# Altium schematic sheet Power.SchDoc
size 594 x 420 mm; SheetNumber: 10; SheetTotal: 10; Обозначение документа: QFP power; Номер листа: 10; Общее количество листов: 10
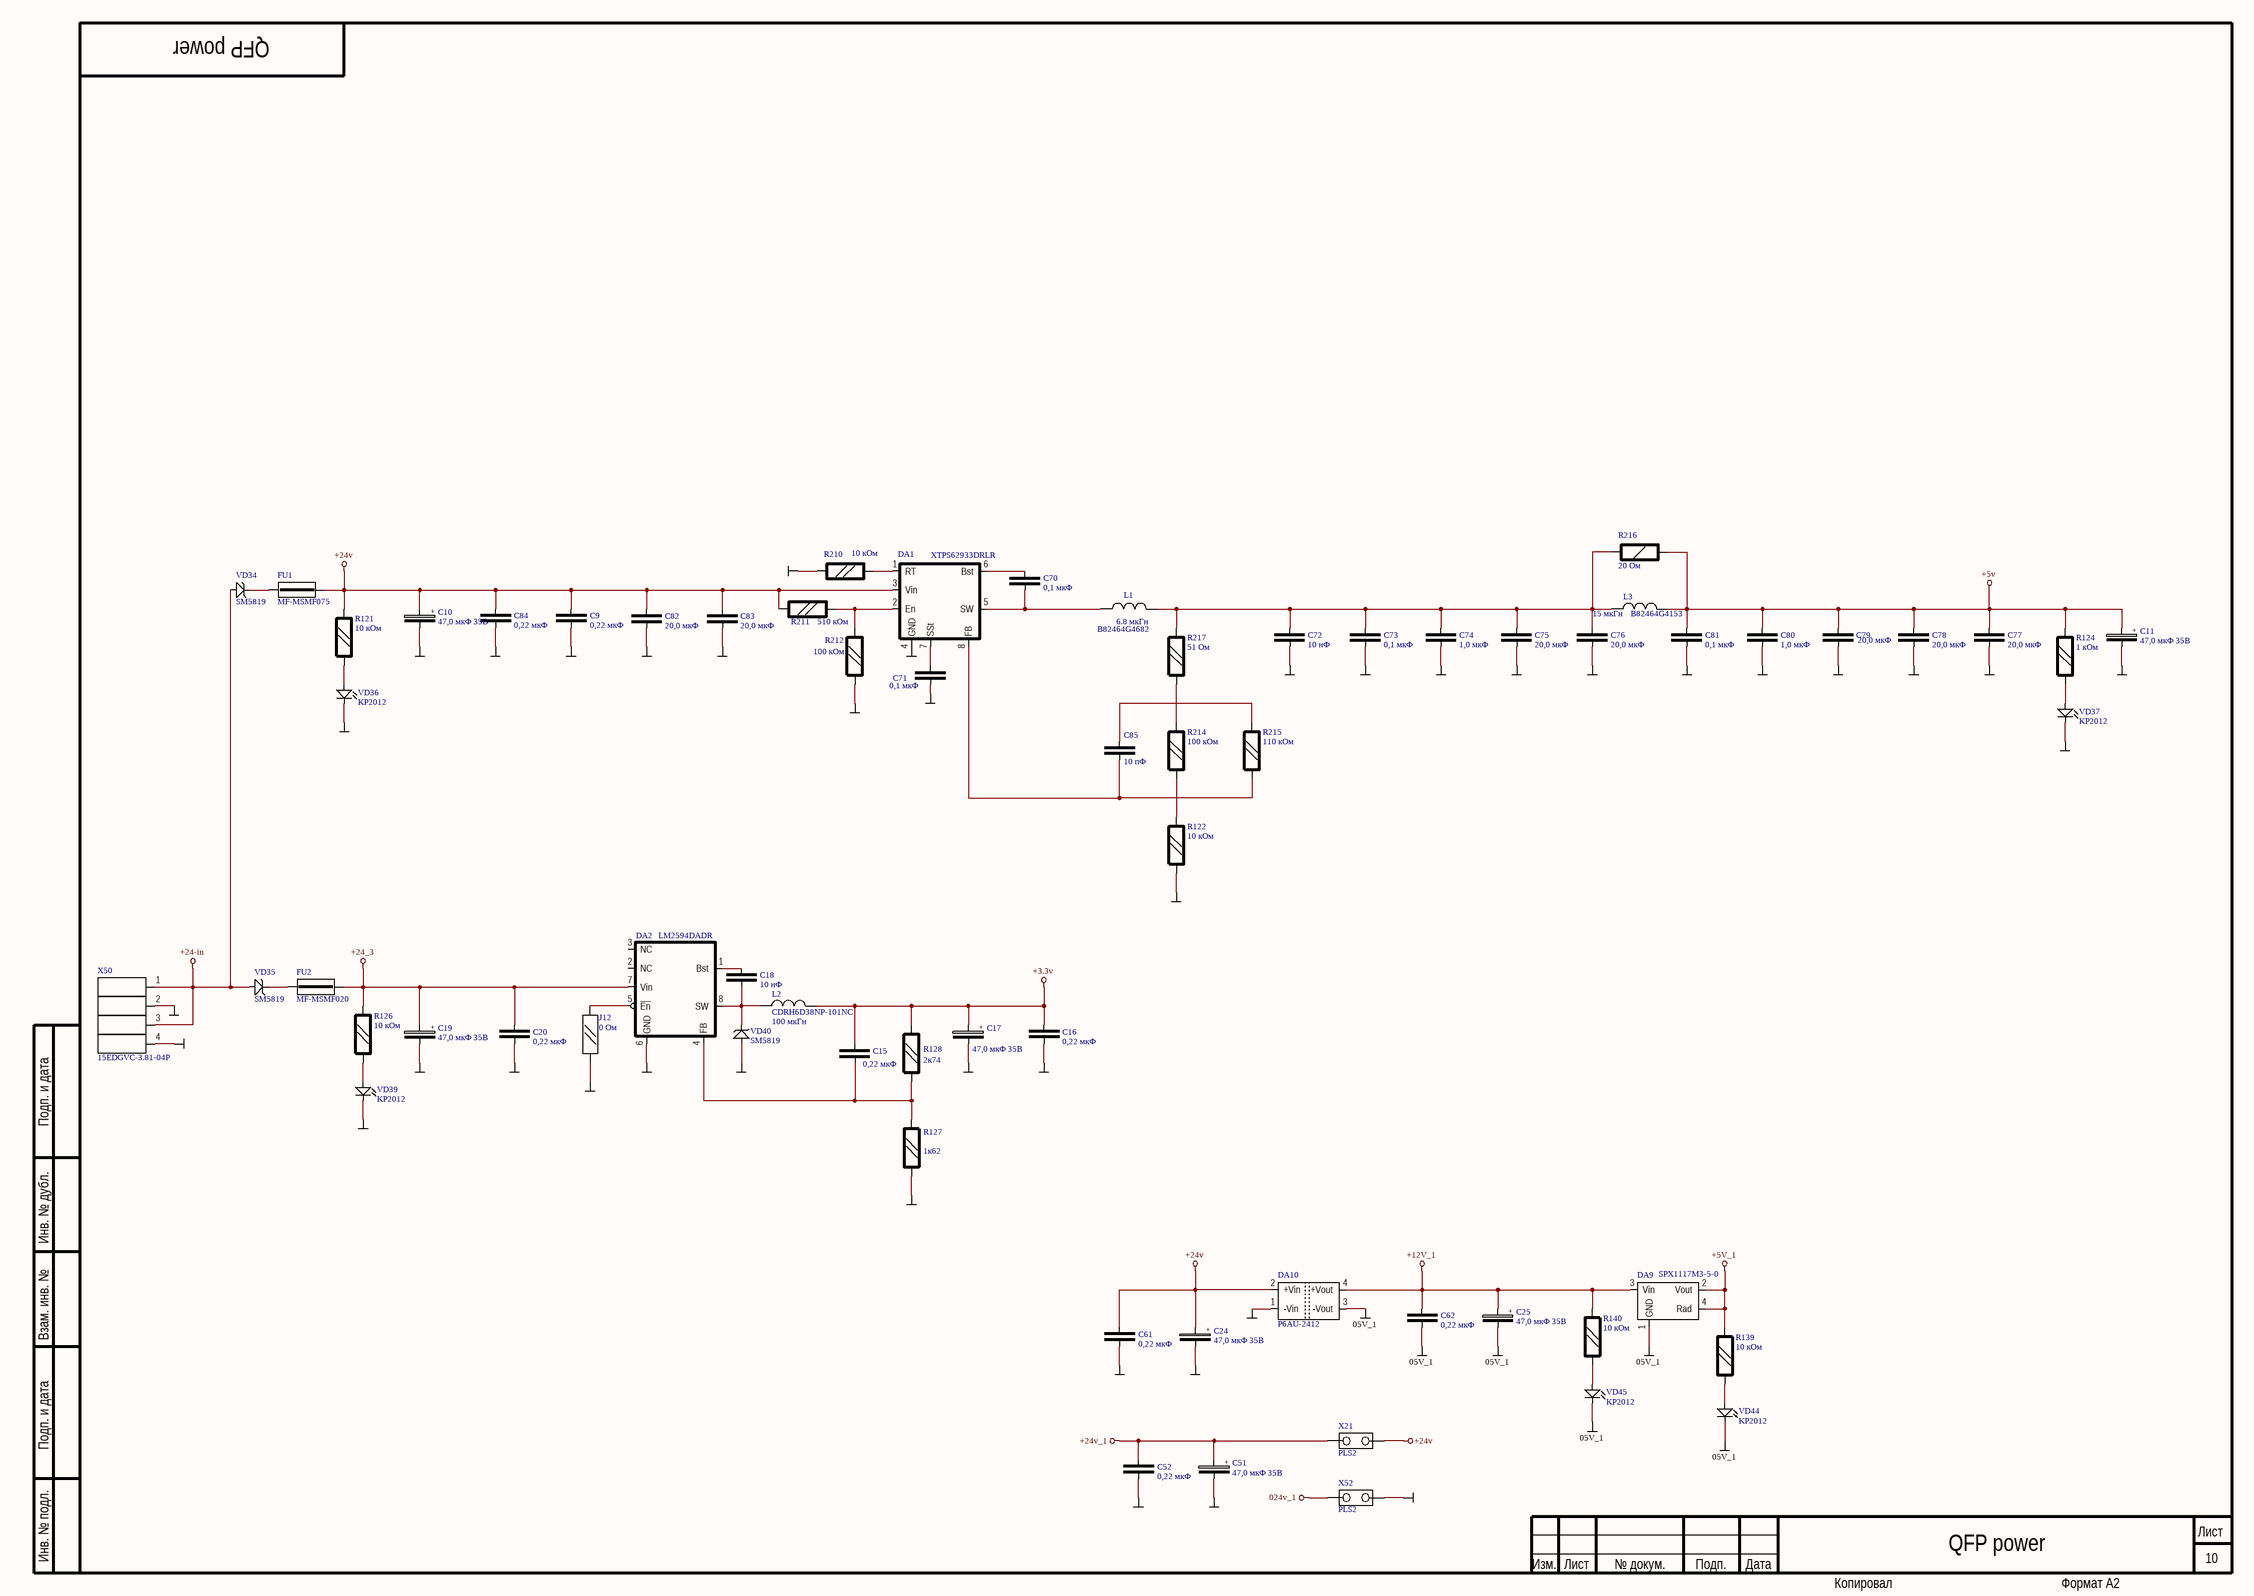
[diagram p0: Power.SchDoc]

## Parts
C9  0,22 мкФ  [RC0805]
C10  47,0 мкФ 35В  [cap6]
C11  47,0 мкФ 35В  [cap6]
C15  0,22 мкФ  [SMD0805CAP]
C16  0,22 мкФ  [RC0805]
C17  47,0 мкФ 35В  [cap6]
C18  10 нФ  [RC0805]
C19  47,0 мкФ 35В  [cap6]
C20  0,22 мкФ  [RC0805]
C24  47,0 мкФ 35В  [cap6]
C25  47,0 мкФ 35В  [cap6]
C51  47,0 мкФ 35В  [cap6]
C52  0,22 мкФ  [SMD0805CAP]
C61  0,22 мкФ  [SMD0805CAP]
C62  0,22 мкФ  [SMD0805CAP]
C70  0,1 мкФ  [SMD0805CAP]
C71  0,1 мкФ  [SMD0805CAP]
C72  10 нФ  [SMD0805CAP]
C73  0,1 мкФ  [SMD0805CAP]
C74  1,0 мкФ  [SMD0805CAP]
C75  20,0 мкФ  [CAPC1206]
C76  20,0 мкФ  [CAPC1206]
C77  20,0 мкФ  [CAPC1206]
C78  20,0 мкФ  [CAPC1206]
C79  20,0 мкФ  [CAPC1206]
C80  1,0 мкФ  [SMD0805CAP]
C81  0,1 мкФ  [SMD0805CAP]
C82  20,0 мкФ  [CAPC1206]
C83  20,0 мкФ  [CAPC1206]
C84  0,22 мкФ  [RC0805]
C85  10 пФ  [RC0805]
DA1  XTPS62933DRLR  [SOT583]
DA2  LM2594DADR  [SO8]
DA9  SPX1117M3-5-0  [SOT223]
DA10  P6AU-2412  [SiP4]
FU1  MF-MSMF075  [MSMF020]
FU2  MF-MSMF020  [MSMF020]
J12  0 Ом  [SMD0805RES]
L1  B82464G4682  Inductance: 6.8 мкГн  [IND_COILCRAFT_MSS1038]
L2  CDRH6D38NP-101NC  Inductance: 100 мкГн  [cdrh6d38np]
L3  B82464G4153  Inductance: 15 мкГн  [IND_COILCRAFT_MSS1038]
R121  10 кОм  [SMD0805RES]
R122  10 кОм  [SMD0805RES]
R124  1 кОм  [SMD0805RES]
R126  10 кОм  [SMD0805RES]
R127  1к62  [SMD0805RES]
R128  2к74  [SMD0805RES]
R139  10 кОм  [SMD0805RES]
R140  10 кОм  [SMD0805RES]
R210  10 кОм  [SMD0805RES]
R211  510 кОм  [SMD0805RES]
R212  100 кОм  [SMD0805RES]
R214  100 кОм  [SMD0805RES]
R215  110 кОм  [SMD0805RES]
R216  20 Ом  [RES1206]
R217  51 Ом  [SMD0805RES]
VD34  SM5819  [MELF]
VD35  SM5819  [MELF]
VD36  KP2012  [SMD0805DIO_C]
VD37  KP2012  [SMD0805DIO_C]
VD39  KP2012  [SMD0805DIO_C]
VD40  SM5819  [MELF]
VD44  KP2012  [SMD0805DIO_C]
VD45  KP2012  [SMD0805DIO_C]
X21  PLS2  [PLS2]
X50  15EDGVC-3.81-04P  [15EDGVC_081_4]
X52  PLS2  [PLS2]

## Nets
05V_1: C25.2(-) C62.2 DA9.1(GND) DA10.3(-Vout) VD44.1(Cathode) VD45.1(Cathode)
024v_1: X52.1
+3.3v: C15.2 C16.1 C17.1(+) L2.1 R128.2
+5v: C11.1(+) C77.2 C78.2 C79.2 C80.2 C81.2 L3.2 R124.2 R216.2
+5V_1: DA9.2(Vout) DA9.4(Rad) R139.1
+12V_1: C25.1(+) C62.1 DA9.3(Vin) DA10.4(+Vout) R140.1
+24-in: VD34.2(Anode) VD35.2(Anode) X50.1 X50.3
+24_3: C19.1(+) C20.1 DA2.7(Vin) FU2.1 R126.2
+24v: C9.1 C10.1(+) C24.1(+) C61.1 C82.2 C83.2 C84.1 DA1.3(Vin) DA10.2(+Vin) FU1.1 R121.2 R211.1 X21.2
+24v_1: C51.1(+) C52.1 X21.1
GND: C9.2 C10.2(-) C11.2(-) C16.2 C17.2(-) C19.2(-) C20.2 C24.2(-) C51.2(-) C52.2 C61.2 C71.1 C72.1 C73.1 C74.1 C75.1 C76.1 C77.1 C78.1 C79.1 C80.1 C81.1 C82.1 C83.1 C84.2 DA1.4(GND) DA2.6(GND) DA10.1(-Vin) J12.2 R122.1 R127.2 R210.1 R212.1 VD36.1(Cathode) VD37.1(Cathode) VD39.1(Cathode) VD40.2(Anode) X50.2 X50.4 X52.2
NetC15_1: C15.1 DA2.4(FB) R127.1 R128.1
NetC18_1: C18.1 DA2.1(Bst)
NetC18_2: C18.2 DA2.8(SW) L2.2 VD40.1(Cathode)
NetC70_1: C70.1 DA1.5(SW) L1.1
NetC70_2: C70.2 DA1.6(Bst)
NetC71_2: C71.2 DA1.7(SSt)
NetC72_2: C72.2 C73.2 C74.2 C75.2 C76.2 L1.2 L3.1 R216.1 R217.2
NetC85_1: C85.1 R215.2
NetC85_2: C85.2 DA1.8(FB) R215.1
NetDA1_1: DA1.1(RT) R210.2
NetDA1_2: DA1.2(En) R211.2 R212.2
NetDA2_5: DA2.5(~{En}) J12.1
NetFU1_2: FU1.2 VD34.1(Cathode)
NetFU2_2: FU2.2 VD35.1(Cathode)
NetR121_1: R121.1 VD36.2(Anode)
NetR122_2: R122.2 R214.1
NetR124_1: R124.1 VD37.2(Anode)
NetR126_1: R126.1 VD39.2(Anode)
NetR139_2: R139.2 VD44.2(Anode)
NetR140_2: R140.2 VD45.2(Anode)
NetR214_2: R214.2 R217.1

Not connected (* = marked no-connect by the designer): DA2 2(NC) 3(NC)

## Notes on the sheet
- Подп. и дата
- Инв. № дубл.
- Взам. инв. №
- Инв. № подл.
- Изм.
- Лист
- № докум.
- Подп.
- Дата
- Копировал
- Формат А2

## Library data of the parts
C9 C16 C18 C20 C84 = C0805Big: Чип конденсатор 0805; Voltage: 50V; Vendor: Generic; Temp: Y5V; Tol: 20%; SolderOptoin: Norm; Price: 2
  C9 C16 C20 C84: Value: 0,22 мкФ
  C18: Value: 10 нФ
C10 C11 C17 C19 C24 C25 C51 = C_e: 5мм Электролитический конденсатор; SolderOption: Norm; Value: 47,0 мкФ 35В
C15 C52 C61 C62 C70-C74 C80 C81 = C0805: Чип конденсатор 0805; Voltage: 50V; Vendor: Generic; Temp: Y5V; Tol: 20%; SolderOpton: Norm; Price: 2
  C15 C52 C61 C62: Value: 0,22 мкФ
  C70 C71 C73 C81: Value: 0,1 мкФ
  C72: Value: 10 нФ
  C74 C80: Value: 1,0 мкФ
C75-C79 C82 C83 = C1206: Чип конденсатор 0805; Voltage: 25V; Vendor: Generic; Temp: Y5V; Tol: 20%; SolderOpton: Norm; Value: 20,0 мкФ; Price: 2; Parameter 1: *
C85 = C0805Big: Чип конденсатор 0805; Voltage: 50V; Vendor: Generic; Temp: NPO; Tol: 20%; SolderOptoin: Norm; Value: 10 пФ; Price: 2
DA1 = XTPS62933DRLR: Понижающий DC/DC конвертор; Vendor: TI; Voltage: 30V; SolderOpton: Norm; Value: XTPS62933DRLR; Price: 400
DA2 = LM2594DADR: Понижающий DC/DC конвертор; Vendor: ON Semi; Voltage: 37V; SolderOpton: Norm; Value: LM2594DADR; Price: 400
DA9 = SPX1117M3: LDO стабилизатор; Vendor: Sipex; Voltage: 20V; SolderOpton: Norm; Value: SPX1117M3-5-0; Price: 20
DA10 = P6AU: Изолированный DC-DC; Vendor: Peak Electronics; Voltage: 24V; SolderOption: Norm; Value: P6AU-2412; Price: 500
FU1 FU2 = MF-MSMF: Предохранитель самовосстанавливающийся; Vendor: Bourns; SolderOption: Norm; Price: 20
  FU1: Value: MF-MSMF075
  FU2: Value: MF-MSMF020
J12 = JR0805: SMD 0805 перемычка; SolderOption: Norm; Price: 2; Vendor: *; Value: 0 Ом
L1 L3 = B82464G4: SMD Дроссель; Vendor: TDK; Curent: 4.3A; Price: 100
  L1: Value: B82464G4682
  L3: Value: B82464G4153
L2 = CDRH6D38NP: SMD Дроссель; Vendor: Sumida; Curent: 0.5A; Price: 100; Value: CDRH6D38NP-101NC
R121 R124 R126 R139 R140 R211 R212 R217 = R0805: Чип резистор 0805; Vendor: Generic; Tolerance: 5%; SolderOpton: Norm; Price: 2
  R121 R126 R139 R140: Value: 10 кОм
  R124: Value: 1 кОм
  R211: Value: 510 кОм
  R212: Value: 100 кОм
  R217: Value: 51 Ом
R122 R127 R128 R210 R214 R215 = R0805: Чип резистор 0805; Vendor: Generic; Tolerance: 1%; SolderOpton: Norm; Price: 2
  R122 R210: Value: 10 кОм
  R127: Value: 1к62
  R128: Value: 2к74
  R214: Value: 100 кОм
  R215: Value: 110 кОм
R216 = R1206: Чип резистор 1206; Vendor: Generic; Tolerance: 5%; SolderOpton: Norm; Price: 2; Value: 20 Ом
VD34 VD35 VD40 = SM5819: Чип шоттки диод MELF; Vendor: Diotec; Voltage: 40V; Current: 1A; SolderOption: Norm; Price: 15; Value: SM5819
VD36 VD37 VD39 VD44 VD45 = KP2012_C: Чип светодиод 0805; Vendor: KB; Color: Green; SolderOpton: Norm; Price: 20; Value: KP2012
X21 X52 = PLS2: Джампер PLS2 2.54мм; SolderOption: Norm; Price: 1; Vendor: *; Value: PLS2
X50 = 15EDGVC-3.81-04P: Вилка  4/3.81; Vendor: Degson; Current: 8А; Voltage: 2кВ; Price: 25; Value: 15EDGVC-3.81-04P